# Altium schematic sheet T962a_Panel.SchDoc
size A4
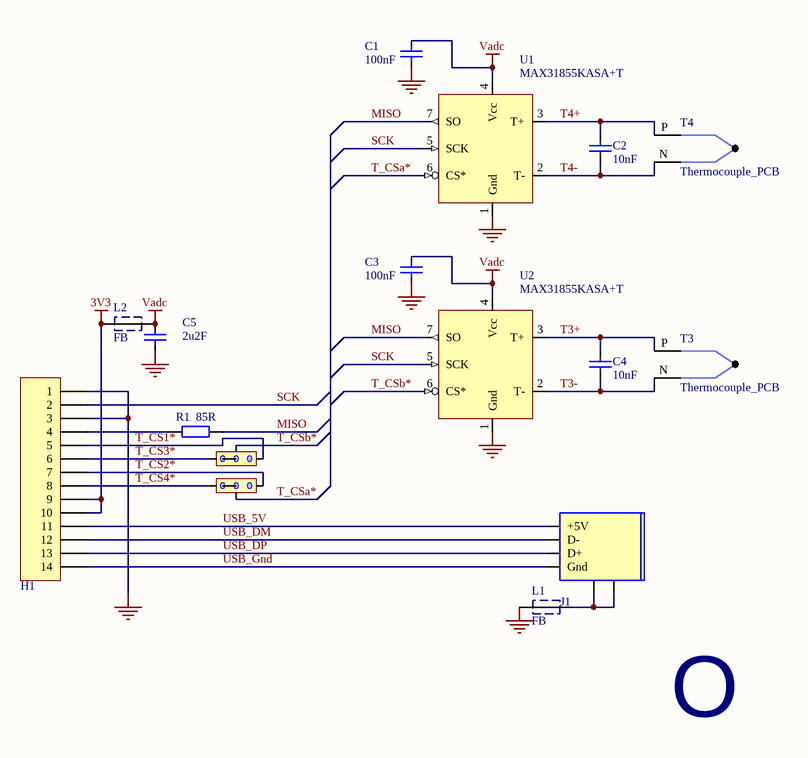
[diagram p0: T962a_Panel.SchDoc]

## Parts
C1  100nF  [CCNP1608-0603]
C2  10nF  [CCNP1608-0603]
C3  100nF  [CCNP1608-0603]
C4  10nF  [CCNP1608-0603]
C5  2u2F  [CCNP2012-0805]
H1  2x5 Header  [HDR2X7H]  (value not drawn)
J1  USB Type B  [USB_BCon - straight pins]  (value not drawn)
L1  FB  [CR2012-0805]
L2  FB  [CR2012-0805]
Logo  OSHW Logo  [OSHW]  (value not drawn)  (no BOM)
R1  85R  [CR2012-0805]
S1  Link3Closed  [SolderBridge3(Closed)]  (value not drawn)  (net tie, no BOM)
S2  Link3Closed  [SolderBridge3(Closed)]  (value not drawn)  (net tie, no BOM)
T3  Thermocouple_PCB  [ThermoCoupleSocket - PCB mount]
T4  Thermocouple_PCB  [ThermoCoupleSocket - PCB mount]
U1  MAX31855KASA+T  [SO-8_L]
U2  MAX31855KASA+T  [SO-8_L]

## Nets
3V3: H1.9 H1.10 L2.1
GND: C1.1 C3.1 C5.1 H1.1 H1.3 L1.1 U1.1(Gnd) U2.1(Gnd)
Vadc: C1.2 C3.2 C5.2 L2.2 U1.4(Vcc) U2.4(Vcc)
MISO: R1.2 U1.7(SO) U2.7(SO)
SCK: H1.2 U1.5(SCK) U2.5(SCK)
T3+: C4.1 T3.P U2.3(T+)
T3-: C4.2 T3.N U2.2(T-)
T4+: C2.1 T4.P U1.3(T+)
T4-: C2.2 T4.N U1.2(T-)
T_CS1*: H1.5 S1.3
T_CS2*: H1.7 S2.3
T_CS3*: H1.6 S1.1
T_CS4*: H1.8 S2.1
T_CSa*: S2.2 U1.6(CS*)
T_CSb*: S1.2 U2.6(CS*)
USB_5V: H1.11 J1.5V(+5V)
USB_DM: H1.12 J1.D-
USB_DP: H1.13 J1.D+
USB_Gnd: H1.14 J1.Gnd
NetH1_4: H1.4 R1.1
NetJ1_Shield1: J1.Shield1(USBShd) J1.Shield2(USBShd) L1.2

Not connected (* = marked no-connect by the designer): U1 8(NC); U2 8(NC)

## Notes on the sheet
- (in symbol OSHW Logo) O

## Library data of the parts
C1-C5 = Cap: Capacitor; Manufacturer: Generic Components; Class: Passive; Published: 08/06/2000; Publisher: Altium Hobart Technology Centre; SubClass: Capacitor; Farnell PN: *; Digikey: *
  C1 C3: Value: 100nF
  C2 C4: Value: 10nF
  C5: Value: 2u2F
H1 = Header 2x7H: Header 2x7
J1 = USB_TYPE_B: USB B Connector; Digikey: *; Farnell PN: *
L1 L2 = Ferrite Bead 0805: Ferrite Bead (0805) 0.045OHM, 2A; Farnell PN: 1515661; Digikey: *
R1 = Res: Resistor; Manufacturer: Generic Components; Class: Passive; Published: 08/06/2000; Publisher: Altium Hobart Technology Centre; SubClass: Resistor; Farnell PN: *; Digikey: *; Value: 85R
T3 T4 = Thermocouple_PCB: Farnell PN: 2347189
U1 U2 = MAX31855KASA+T: Farnell PN: 2515622